# Altium schematic sheet S7CAS-PLEIADES-CARTE-MERE_Pxx_MOTEUR.SchDoc
size Tabloid; SheetNumber: 13; SheetTotal: 18; Sheet_Name: MOTEUR; Size: 11x17
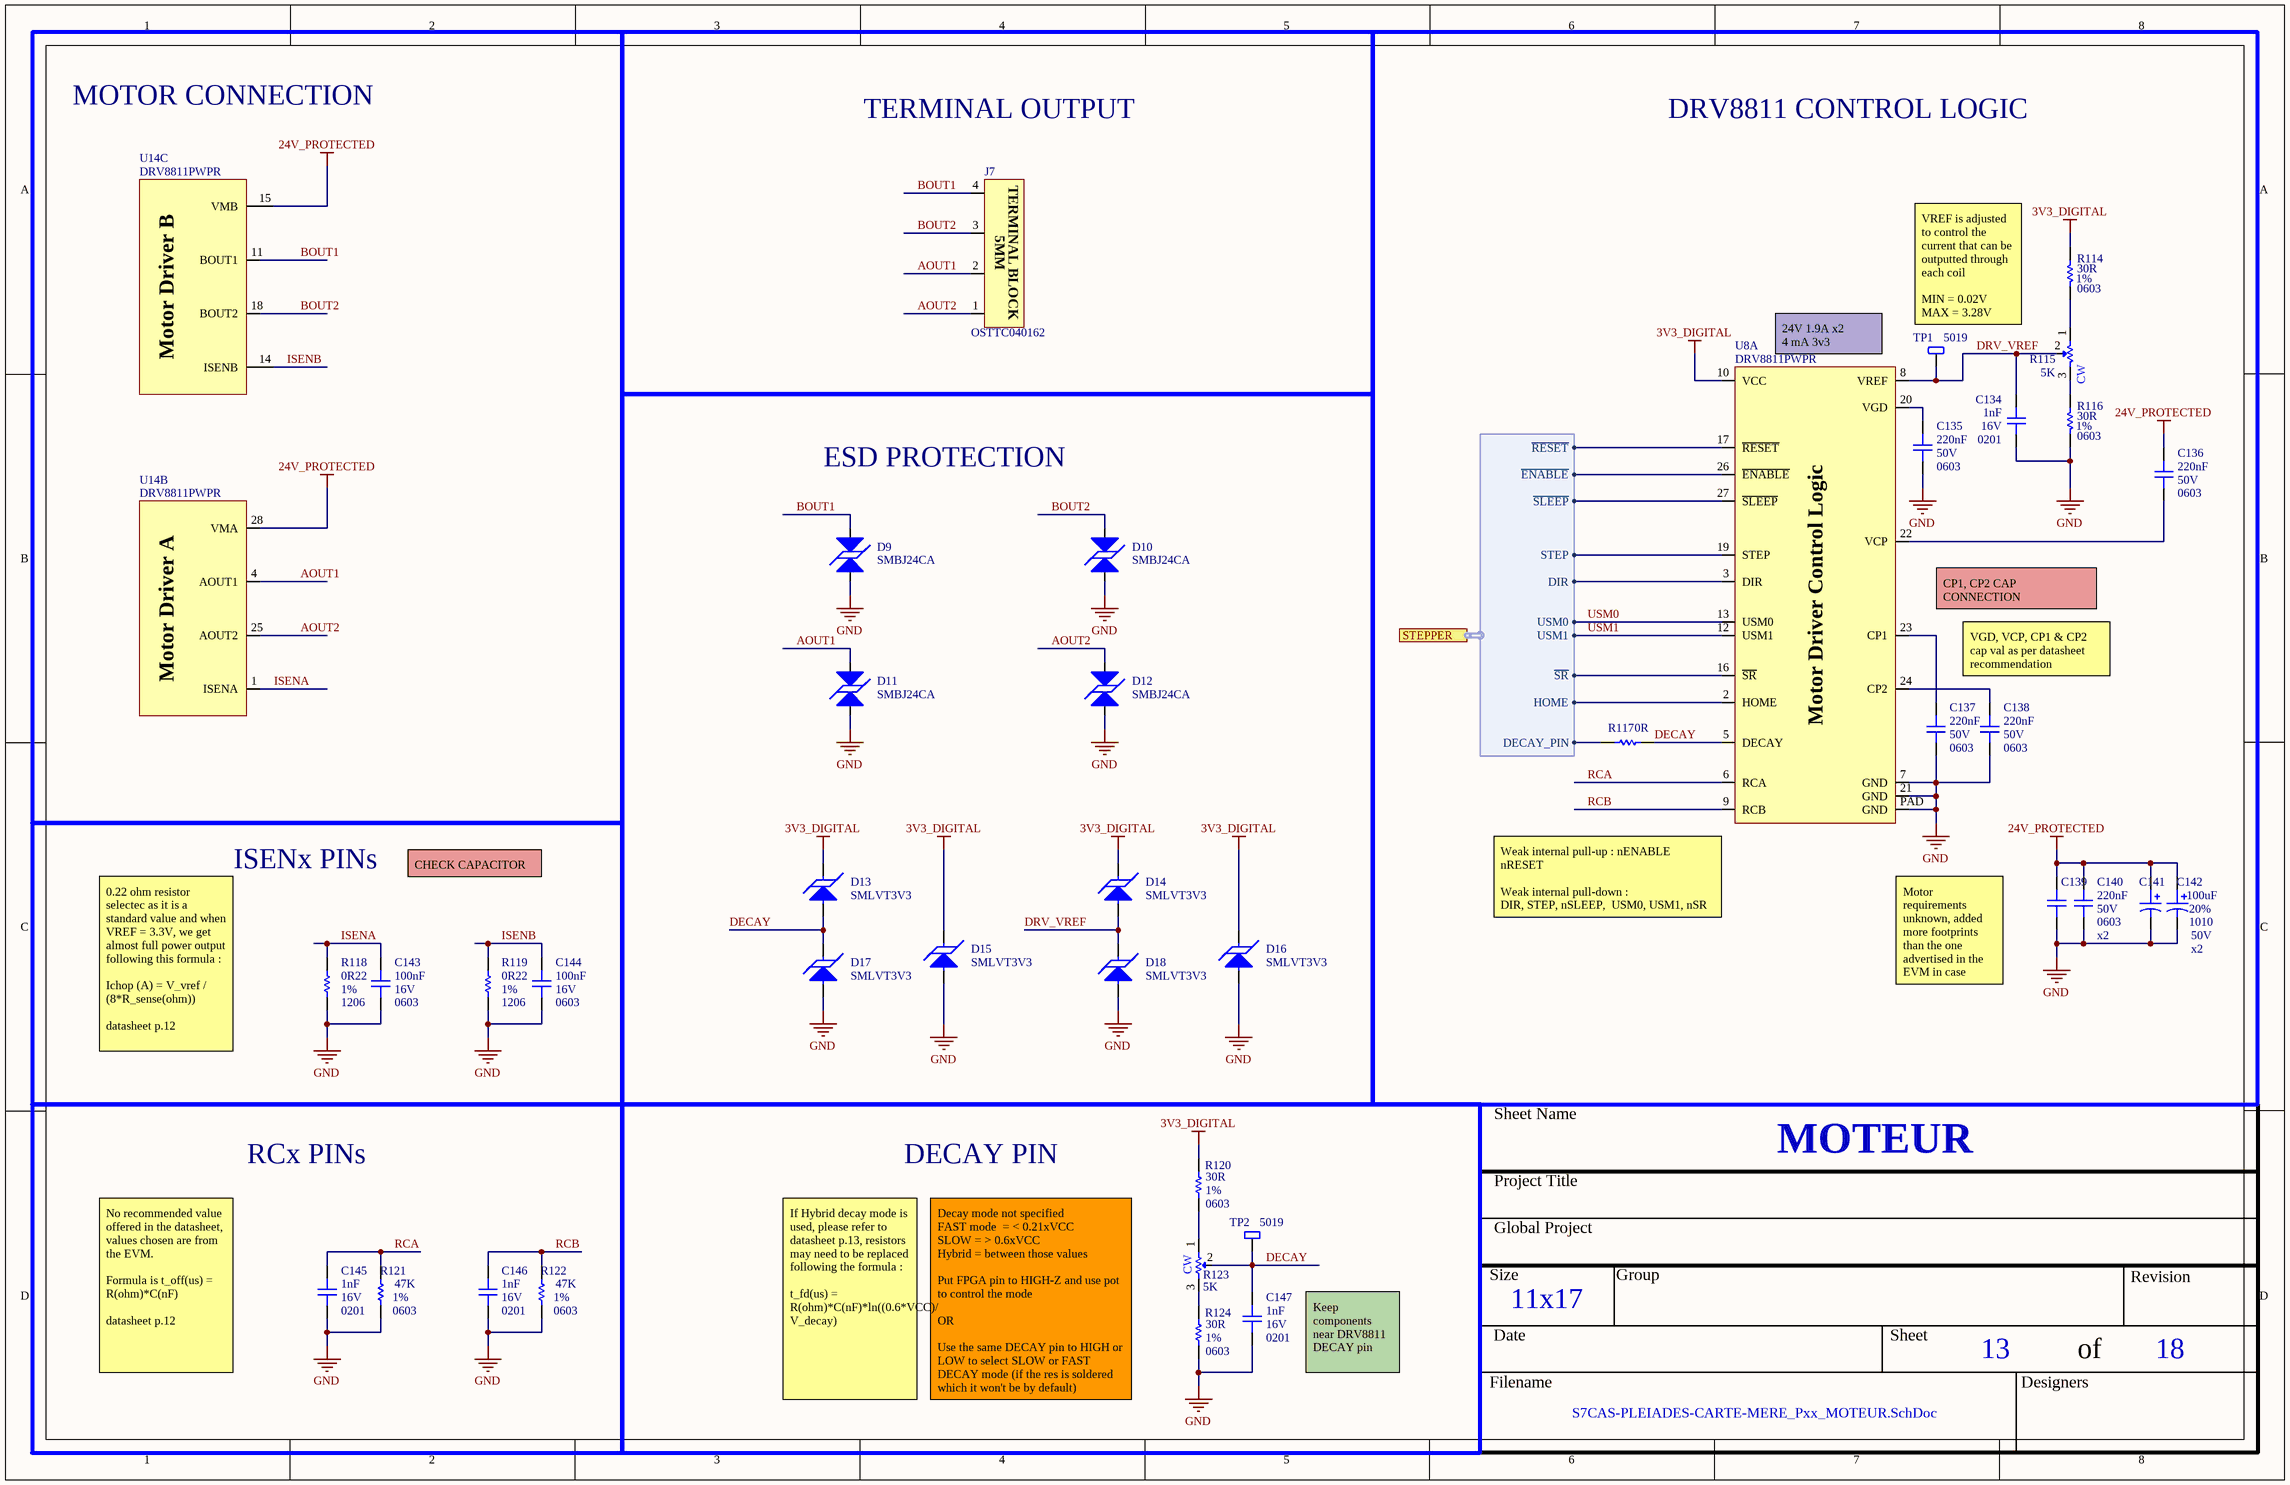
[diagram p0: S7CAS-PLEIADES-CARTE-MERE_Pxx_MOTEUR.SchDoc]

## Parts
C134  value 1nF  Voltage: 16V  Package: 0201  [CAP_0201]  (hidden comment: CAP - 0201)
C135  value 220nF  Voltage: 50V  Package: 0603  [CAP_0603]  (hidden comment: CAP - 0603)
C136  value 220nF  Voltage: 50V  Package: 0603  [CAP_0603]  (hidden comment: CAP - 0603)
C137  value 220nF  Voltage: 50V  Package: 0603  [CAP_0603]  (hidden comment: CAP - 0603)
C138  value 220nF  Voltage: 50V  Package: 0603  [CAP_0603]  (hidden comment: CAP - 0603)
C139  CAP - 0603  [CAP_0603]  (value not drawn)
C140  value 220nF  Voltage: 50V  Package: 0603  [CAP_0603]  (hidden comment: CAP - 0603)
C141  MAL215099101E3  [CAP_ALU_1010_vishay]  (value not drawn)
C142  value 100uF  Voltage: 50V  Package: 1010  Precision: 20%  [CAP_ALU_1010_vishay]  (hidden comment: MAL215099101E3)
C143  value 100nF  Voltage: 16V  Package: 0603  [CAP_0603]  (hidden comment: CAP - 0603)
C144  value 100nF  Voltage: 16V  Package: 0603  [CAP_0603]  (hidden comment: CAP - 0603)
C145  value 1nF  Voltage: 16V  Package: 0201  [CAP_0201]  (hidden comment: CAP - 0201)
C146  value 1nF  Voltage: 16V  Package: 0201  [CAP_0201]  (hidden comment: CAP - 0201)
C147  value 1nF  Voltage: 16V  Package: 0201  [CAP_0201]  (hidden comment: CAP - 0201)
D9  SMBJ24CA  [TVS_PWR_SMBJ36CA]
D10  SMBJ24CA  [TVS_PWR_SMBJ36CA]
D11  SMBJ24CA  [TVS_PWR_SMBJ36CA]
D12  SMBJ24CA  [TVS_PWR_SMBJ36CA]
D13  SMLVT3V3  [TVS_POW_SMLVT3V3]
D14  SMLVT3V3  [TVS_POW_SMLVT3V3]
D15  SMLVT3V3  [TVS_POW_SMLVT3V3]
D16  SMLVT3V3  [TVS_POW_SMLVT3V3]
D17  SMLVT3V3  [TVS_POW_SMLVT3V3]
D18  SMLVT3V3  [TVS_POW_SMLVT3V3]
J7  OSTTC040162  [CONN_TERMINAL_OSTTA040161]
R114  value 30R  Package: 0603  Precision: 1%  [RES_0603]  (hidden comment: RES - 0603)
R115  value 5K  [POT_J_LEAD_TOP]  (hidden comment: Part Number)
R116  value 30R  Package: 0603  Precision: 1%  [RES_0603]  (hidden comment: RES - 0603)
R117  value 0R  [RES_0603]  (hidden comment: RES - 0603)
R118  value 0R22  Package: 1206  Precision: 1%  [RES_1206]  (hidden comment: RES - 1206)
R119  value 0R22  Package: 1206  Precision: 1%  [RES_1206]  (hidden comment: RES - 1206)
R120  value 30R  Package: 0603  Precision: 1%  [RES_0603]  (hidden comment: RES - 0603)
R121  value 47K  Package: 0603  Precision: 1%  [RES_0603]  (hidden comment: RES - 0603)
R122  value 47K  Package: 0603  Precision: 1%  [RES_0603]  (hidden comment: RES - 0603)
R123  value 5K  [POT_J_LEAD_TOP]  (hidden comment: Part Number)
R124  value 30R  Package: 0603  Precision: 1%  [RES_0603]  (hidden comment: RES - 0603)
TP1  5019  [TPO_SMD_5019]
TP2  5019  [TPO_SMD_5019]
U8  DRV8811PWPR  [POW_MOTOR_DRV8811PWPR]  (part A of 3)
U14  DRV8811PWPR  [POW_MOTOR_DRV8811PWPR]  (parts B,C of 3)

## Blocks framed on the sheet
MOTOR CONNECTION: U14
TERMINAL OUTPUT: J7
DRV8811 CONTROL LOGIC: C134-C142 R114-R117 TP1 U8
ESD PROTECTION: D9-D18
ISENx PINs: C143 C144 R118 R119
RCx PINs: C145 C146 R121 R122
DECAY PIN: C147 R120 R123 R124 TP2

## Ports
STEPPER (harness STEPPER_MOTOR_DRIVER_HARNESS, see S7CAS-PLEIADES-CARTE-MERE_Pxx_FPGA_bank0_1_5[1A])

## Harnesses
STEPPER_MOTOR_DRIVER_HARNESS: ~{RESET}, ~{ENABLE}, ~{SLEEP}, STEP, DIR, USM0, USM1, ~{SR}, HOME, DECAY_PIN

## Nets
3V3_DIGITAL: D13.K D14.K D15.K D16.K R114.1 R120.1 U8.10(VCC)
24V_PROTECTED: C136.2 C139.2 C140.2 C141.1 C142.1 U14.15(VMB) U14.28(VMA)
GND: C134.1 C135.1 C137.1 C138.1 C139.1 C140.1 C141.2 C142.2 C143.1 C144.1 C145.1 C146.1 C147.1 D9.2 D10.2 D11.2 D12.2 D15.A D16.A D17.A D18.A R116.2 R118.1 R119.1 R121.1 R122.1 R124.2 U8.7(GND) U8.21(GND) U8.PAD(GND)
AOUT1: D11.1 J7.2 U14.4(AOUT1)
AOUT2: D12.1 J7.1 U14.25(AOUT2)
BOUT1: D9.1 J7.4 U14.11(BOUT1)
BOUT2: D10.1 J7.3 U14.18(BOUT2)
DECAY: C147.2 D13.A D17.K R117.1 R123.2 TP2.1 U8.5(DECAY)
DRV_VREF: C134.2 D14.A D18.K R115.2 TP1.1 U8.8(VREF)
ISENA: C143.2 R118.2 U14.1(ISENA)
ISENB: C144.2 R119.2 U14.14(ISENB)
RCA: C145.2 R121.2 U8.6(RCA)
RCB: C146.2 R122.2 U8.9(RCB)
USM0: U8.13(USM0) ; port STEPPER.USM0
USM1: U8.12(USM1) ; port STEPPER.USM1
NetC135_2: C135.2 U8.20(VGD)
NetC136_1: C136.1 U8.22(VCP)
NetC137_2: C137.2 U8.23(CP1)
NetC138_2: C138.2 U8.24(CP2)
NetR114_2: R114.2 R115.1
NetR115_3: R115.3 R116.1
NetR117_2: R117.2 ; port STEPPER.DECAY_PIN
NetR120_2: R120.2 R123.1
NetR123_3: R123.3 R124.1
NetU8_2: U8.2(HOME) ; port STEPPER.HOME
NetU8_3: U8.3(DIR) ; port STEPPER.DIR
NetU8_16: U8.16(~{SR}) ; port STEPPER.~{SR}
NetU8_17: U8.17(~{RESET}) ; port STEPPER.~{RESET}
NetU8_19: U8.19(STEP) ; port STEPPER.STEP
NetU8_26: U8.26(~{ENABLE}) ; port STEPPER.~{ENABLE}
NetU8_27: U8.27(~{SLEEP}) ; port STEPPER.~{SLEEP}

## Notes on the sheet
- (near U8) 24V 1.9A x2
  4 mA 3v3
- VREF is adjusted to control the current that can be outputted through each coil
  MIN = 0.02V
  MAX = 3.28V
- (near U8) CP1, CP2 CAP CONNECTION
- VGD, VCP, CP1 & CP2 cap val as per datasheet recommendation
- CHECK CAPACITOR
- (near U8) Weak internal pull-up : nENABLE nRESET
  Weak internal pull-down :
  DIR, STEP, nSLEEP,  USM0, USM1, nSR
- (near C140) x2
- x2
- Motor requirements unknown, added more footprints than the one advertised in the EVM in case needed
- 0.22 ohm resistor selectec as it is a standard value and when VREF = 3.3V, we get almost full power output following this formula :
  Ichop (A) = V_vref / (8*R_sense(ohm))
  datasheet p.12
- No recommended value offered in the datasheet, values chosen are from the EVM.
  Formula is t_off(us) = R(ohm)*C(nF)
  datasheet p.12
- Keep components near DRV8811 DECAY pin
- If Hybrid decay mode is used, please refer to datasheet p.13, resistors may need to be replaced following the formula :
  t_fd(us) = R(ohm)*C(nF)*ln((0.6*VCC)/ V_decay)
- Decay mode not specified
  FAST mode  = < 0.21xVCC
  SLOW = > 0.6xVCC
  Hybrid = between those values
  Put FPGA pin to HIGH-Z and use pot to control the mode
  OR
  Use the same DECAY pin to HIGH or LOW to select SLOW or FAST DECAY mode (if the res is soldered which it won't be by default)
- Sheet Name
- Project Title
- Global Project
- Size
- Group
- Revision
- Date
- Sheet
- of
- Filename
- Designers
- (in symbol CONN_TERMINAL_OSTTC040162) 5MM; TERMINAL BLOCK
- (in symbol POT - TOP ADJ) CW
- (in symbol POW_MOTOR_DRV8811PWPR, part A) Motor Driver Control Logic
- (in symbol POW_MOTOR_DRV8811PWPR, part B) Motor Driver A
- (in symbol POW_MOTOR_DRV8811PWPR, part C) Motor Driver B

## Library data of the parts
C134 C145-C147 = CAP - 0201: Precision: 10%; Current: *; CreatedBy: Jonathan Bouchard; Power: *; Supplier 1: Avnet; Supplier Part Number 1: GRM033R71C102KA01J
C135-C138 C140 C143 C144 = CAP - 0603: Precision: 10%; Current: *; CreatedBy: Jonathan Bouchard; Power: *
  C135-C138 C140: Supplier 1: Arrow Electronic; Supplier Part Number 1: GRM188R71H224KAC4D
  C143 C144: Supplier 1: Arrow Electronics; Supplier Part Number 1: CL10B104KO8NNNC
C139 = CAP - 0603: Precision: 10%; Voltage: 50V; Value: 220nF; Current: *; CreatedBy: Jonathan Bouchard; Power: *; Package: 0603; Supplier 1: Arrow Electronic; Supplier Part Number 1: GRM188R71H224KAC4D
C141 C142 = CAP_ALU_MAL215099101E3: CAP - ALU 100uF 20% 50V - 1010; Current: 490mA; Mfg: Vishay Dale; Mfg Part Number: MAL215099101E3; HelpURL: http://www.vishay.com/docs/28395/150crz.pdf; CreatedBy: Jonathan Bouchard; Temperature: -55°C to 125°C; Power: *; Supplier 1: Digikey; Supplier Part Number 1: 4399PHDKR-ND
  C141: Voltage: 50V; Package: 1010; Precision: 20%; Value: 100uF
D9-D12 = TVS_PWR_SMBJ24CA: TVS - 24V 26.7V 600W - DO214AA; Manufacturer #1: Littelfuse Inc.; Value: Vbr = 26.7V -  Clamp = 38.9V; Voltage Rating: 24V Standoff; Current Rating: 15.5A; GRAMS Lib Spec: 2.8; Magnetic Material: UNKNOWN; Polarized: NO; Tolerance: *; Power Max: 600W; HelpURL: http://www.littelfuse.com/~/media/electronics/datasheets/tvs_diodes/littelfuse_tvs_diode_smbj_datasheet.pdf.pdf; CreatedBy/Date: Arnaud Samson - 06/07/18; VerifiedBy: Jonathan Bouchard - 2018-07-13; Temperature: -65°C ~ 150°C (TJ); Package: DO214AA; Manufacturer #2: *; Note: *; Assembly Type: SMD; Part Number #2: *; Part Number #1: SMBJ24CA; Supplier 1: Digi-Key; Supplier Part Number 1: SMBJ24CALFCT-ND; Cryo: UNKNOWN
D13-D18 = TVS_POW_SMLVT3V3: TVS - 3.3V 10.3V 600W - DO214AA; Manufacturer #1: STMicroelectronics; Value: Vbr = 4.1V -  Clamp = 10.3V; Voltage Rating: 3.3V Standoff; Current Rating: 200A (Ifsm); Power Max: 600W (Ppp); GRAMS Lib Spec: 2.8; Magnetic Material: UNKNOWN; Polarized: YES; Tolerance: *; HelpURL: https://www.st.com/content/ccc/resource/technical/document/datasheet/da/a4/86/90/17/13/47/7c/CD00000923.pdf/files/CD00000923.pdf/jcr:content/translations/en.CD00000923.pdf; CreatedBy/Date: Jonathan Bouchard - 2019-04-27; VerifiedBy: Nicolas V. (2019-05-06); Temperature: -55°C ~ 175°C (TJ); Package: DO214AA; Manufacturer #2: *; Note: *; Assembly Type: SMD; Part Number #2: *; Part Number #1: SMLVT3V3; Supplier 1: Digi-Key; Supplier Part Number 1: 497-2496-1-ND; Cryo: UNKNOWN
J7 = CONN_TERMINAL_OSTTC040162: CONN -  TERMINAL BLOCK 4POS 5MM - TH; Mfg: On Shore Technology Inc.; Voltage: *; Current: *; Power: *; Mfg Part Number: OSTTC040162; HelpURL: http://www.on-shore.com/wp-content/uploads/2015/09/osttcxx0162.pdf; CreatedBy: Jonathan Bouchard; Temperature: -30°C ~ 105°C; Value: *; Precision: *; Package: TH-4; Supplier 1: Digikey; Supplier Part Number 1: ED2602-ND
R115 R123 = POT - TOP ADJ: POT - 0.1W, 1/10W Surface Mount Trimmer Potentiometer Cermet 1.0 Turn Top Adjustment; GRAMS Lib Spec: 2.7
R117 = RES - 0603: Precision: 1%; Current: *; CreatedBy: Jonathan Bouchard; Package: 0603; Supplier 1: Arrow Electronics; Supplier Part Number 1: RMCF0603ZT0R00
TP1 TP2 = TPO_SMD_5019: TPO - PC TEST POINT MINI - SMD; Manufacturer #1: Keystone Electronics; Value: 3.81mm x 2.03mm; Polarized: No; Magnetic Material: UNKNOWN; GRAMS Lib Spec: 2.8; Current Rating: *; Manufacturer #2: *; Note: *; Power Max: *; Part Number #2: *; HelpURL: https://www.digikey.ca/product-detail/en/keystone-electronics/5019/36-5019CT-ND/3907344; Supplier 1: Digi-Key; Supplier Part Number 1: 36-5019CT-ND; Assembly Type: SMD; Part Number #1: 5019; Package: SMD; CreatedBy/Date: Olivier Bernard / 5/12/2017; Temperature: *; Tolerance: *; VerifiedBy: Caroline Paulin / 5 juillet 2018; Voltage Rating: *; Cryo: UNKNOWN
U8 U14 = POW_MOTOR_DRV8811PWPR: POW - STEPPER MOTOR DRIVER - SOP-28; Voltage: 3 V ~ 5.5 V / 8 V ~ 38 V; Mfg: Texas Instrument; Current: *; Power: *; Mfg Part Number: DRV8811PWPR; HelpURL: http://www.ti.com/lit/ds/symlink/drv8811.pdf; CreatedBy: Jonathan Bouchard; Temperature: -40°C ~ 150°C (TJ); Value: *; Precision: *; Package: SOP-28; Supplier 1: Digikey; Supplier Part Number 1: 296-24591-1-ND
R114 R116 R120-R122 R124 = RES - 0603: Current: *; CreatedBy: Jonathan Bouchard; Supplier 1: Arrow Electronics
  R114 R116 R120 R124: Supplier Part Number 1: RMCF0603FT30R0
  R121 R122: Supplier Part Number 1: RMCF0603FT47K0
R118 R119 = RES - 1206: Current: *; CreatedBy: Jonathan Bouchard; Supplier 1: Mouser; Supplier Part Number 1: 667-ERJ-8RQFR22V